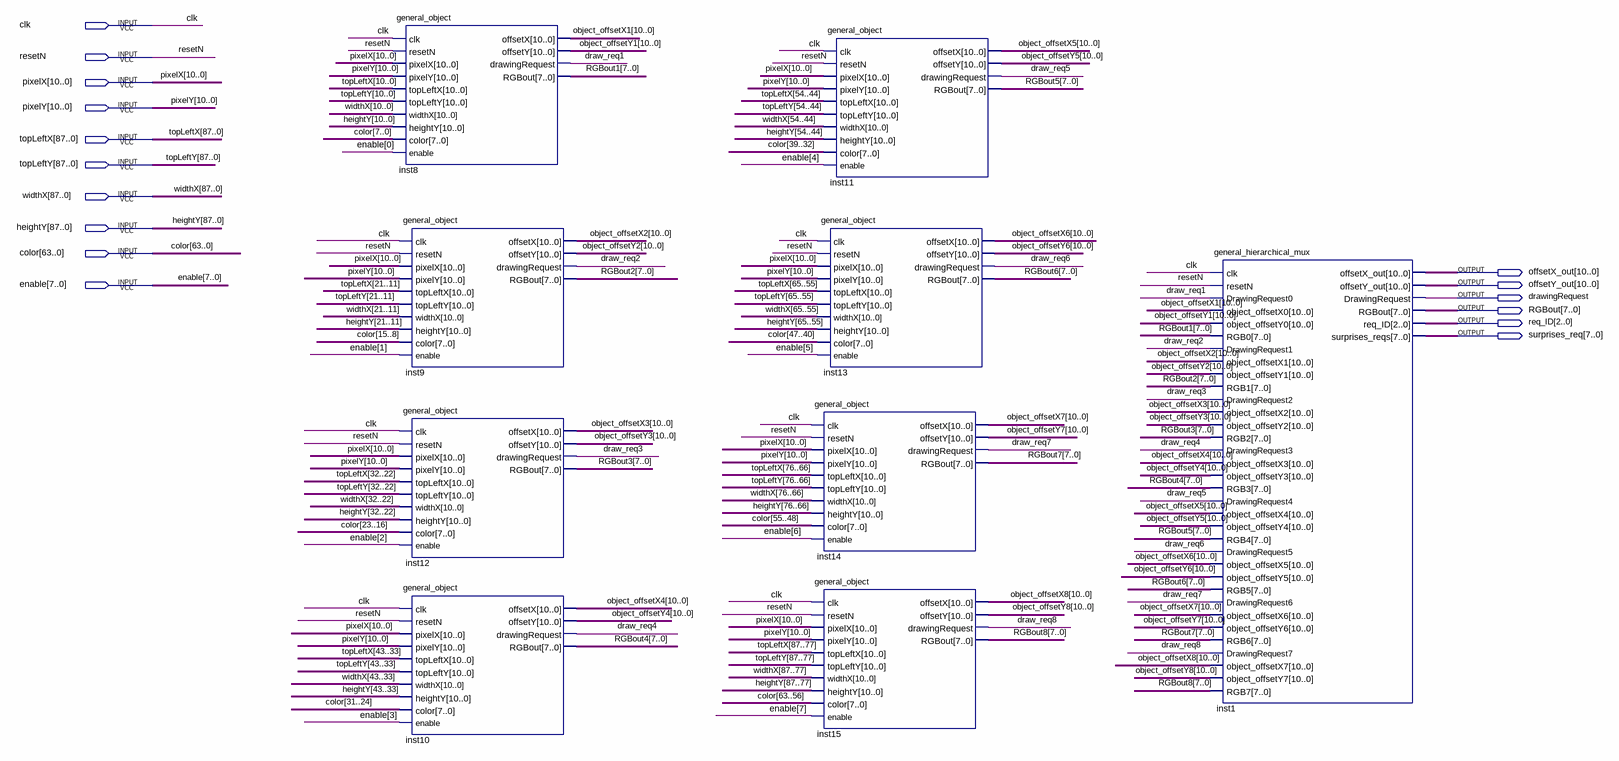
[diagram p0: schematic sheet]
// Quartus schematic objects_master_schematic.bdf as structural Verilog: 9 symbols, 16 pins
module objects_master_schematic (
  input  clk,
  input  resetN,
  input  [10:0] pixelX,
  input  [10:0] pixelY,
  input  [87:0] topLeftX,
  input  [87:0] topLeftY,
  input  [87:0] widthX,
  input  [87:0] heightY,
  input  [63:0] color,
  input  [7:0] enable,
  output [10:0] offsetX_out,
  output [10:0] offsetY_out,
  output drawingRequest,
  output [7:0] RGBout,
  output [2:0] req_ID,
  output [7:0] surprises_req
);

  wire draw_req1, draw_req2, draw_req3, draw_req4, draw_req5, draw_req6, draw_req7, draw_req8;
  wire [7:0] RGBout1, RGBout2, RGBout3, RGBout4, RGBout5, RGBout6, RGBout7, RGBout8;
  wire [10:0] object_offsetX1, object_offsetX2, object_offsetX3, object_offsetX4, object_offsetX5,
       object_offsetX6, object_offsetX7, object_offsetX8, object_offsetY1, object_offsetY2, object_offsetY3,
       object_offsetY4, object_offsetY5, object_offsetY6, object_offsetY7, object_offsetY8;

  general_object inst8 (
    .clk(clk), .resetN(resetN), .pixelX(pixelX), .pixelY(pixelY), .topLeftX(topLeftX[10:0]),
    .topLeftY(topLeftY[10:0]), .widthX(widthX[10:0]), .heightY(heightY[10:0]), .color(color[7:0]),
    .enable(enable[0]), .offsetX(object_offsetX1), .offsetY(object_offsetY1), .drawingRequest(draw_req1),
    .RGBout(RGBout1));
  general_object inst9 (
    .clk(clk), .resetN(resetN), .pixelX(pixelX), .pixelY(pixelY), .topLeftX(topLeftX[21:11]),
    .topLeftY(topLeftY[21:11]), .widthX(widthX[21:11]), .heightY(heightY[21:11]), .color(color[15:8]),
    .enable(enable[1]), .offsetX(object_offsetX2), .offsetY(object_offsetY2), .drawingRequest(draw_req2),
    .RGBout(RGBout2));
  general_object inst12 (
    .clk(clk), .resetN(resetN), .pixelX(pixelX), .pixelY(pixelY), .topLeftX(topLeftX[32:22]),
    .topLeftY(topLeftY[32:22]), .widthX(widthX[32:22]), .heightY(heightY[32:22]), .color(color[23:16]),
    .enable(enable[2]), .offsetX(object_offsetX3), .offsetY(object_offsetY3), .drawingRequest(draw_req3),
    .RGBout(RGBout3));
  general_object inst10 (
    .clk(clk), .resetN(resetN), .pixelX(pixelX), .pixelY(pixelY), .topLeftX(topLeftX[43:33]),
    .topLeftY(topLeftY[43:33]), .widthX(widthX[43:33]), .heightY(heightY[43:33]), .color(color[31:24]),
    .enable(enable[3]), .offsetX(object_offsetX4), .offsetY(object_offsetY4), .drawingRequest(draw_req4),
    .RGBout(RGBout4));
  general_object inst11 (
    .clk(clk), .resetN(resetN), .pixelX(pixelX), .pixelY(pixelY), .topLeftX(topLeftX[54:44]),
    .topLeftY(topLeftY[54:44]), .widthX(widthX[54:44]), .heightY(heightY[54:44]), .color(color[39:32]),
    .enable(enable[4]), .offsetX(object_offsetX5), .offsetY(object_offsetY5), .drawingRequest(draw_req5),
    .RGBout(RGBout5));
  general_object inst13 (
    .clk(clk), .resetN(resetN), .pixelX(pixelX), .pixelY(pixelY), .topLeftX(topLeftX[65:55]),
    .topLeftY(topLeftY[65:55]), .widthX(widthX[65:55]), .heightY(heightY[65:55]), .color(color[47:40]),
    .enable(enable[5]), .offsetX(object_offsetX6), .offsetY(object_offsetY6), .drawingRequest(draw_req6),
    .RGBout(RGBout6));
  general_object inst14 (
    .clk(clk), .resetN(resetN), .pixelX(pixelX), .pixelY(pixelY), .topLeftX(topLeftX[76:66]),
    .topLeftY(topLeftY[76:66]), .widthX(widthX[76:66]), .heightY(heightY[76:66]), .color(color[55:48]),
    .enable(enable[6]), .offsetX(object_offsetX7), .offsetY(object_offsetY7), .drawingRequest(draw_req7),
    .RGBout(RGBout7));
  general_object inst15 (
    .clk(clk), .resetN(resetN), .pixelX(pixelX), .pixelY(pixelY), .topLeftX(topLeftX[87:77]),
    .topLeftY(topLeftY[87:77]), .widthX(widthX[87:77]), .heightY(heightY[87:77]), .color(color[63:56]),
    .enable(enable[7]), .offsetX(object_offsetX8), .offsetY(object_offsetY8), .drawingRequest(draw_req8),
    .RGBout(RGBout8));
  general_hierarchical_mux inst1 (
    .clk(clk), .resetN(resetN), .DrawingRequest0(draw_req1), .object_offsetX0(object_offsetX1),
    .object_offsetY0(object_offsetY1), .RGB0(RGBout1), .DrawingRequest1(draw_req2),
    .object_offsetX1(object_offsetX2), .object_offsetY1(object_offsetY2), .RGB1(RGBout2),
    .DrawingRequest2(draw_req3), .object_offsetX2(object_offsetX3), .object_offsetY2(object_offsetY3),
    .RGB2(RGBout3), .DrawingRequest3(draw_req4), .object_offsetX3(object_offsetX4),
    .object_offsetY3(object_offsetY4), .RGB3(RGBout4), .DrawingRequest4(draw_req5),
    .object_offsetX4(object_offsetX5), .object_offsetY4(object_offsetY5), .RGB4(RGBout5),
    .DrawingRequest5(draw_req6), .object_offsetX5(object_offsetX6), .object_offsetY5(object_offsetY6),
    .RGB5(RGBout6), .DrawingRequest6(draw_req7), .object_offsetX6(object_offsetX7),
    .object_offsetY6(object_offsetY7), .RGB6(RGBout7), .DrawingRequest7(draw_req8),
    .object_offsetX7(object_offsetX8), .object_offsetY7(object_offsetY8), .RGB7(RGBout8),
    .offsetX_out(offsetX_out), .offsetY_out(offsetY_out), .DrawingRequest(drawingRequest), .RGBout(RGBout),
    .req_ID(req_ID), .surprises_reqs(surprises_req));
endmodule
